# EAGLE design TI_amp (EAGLE 6.5.0)
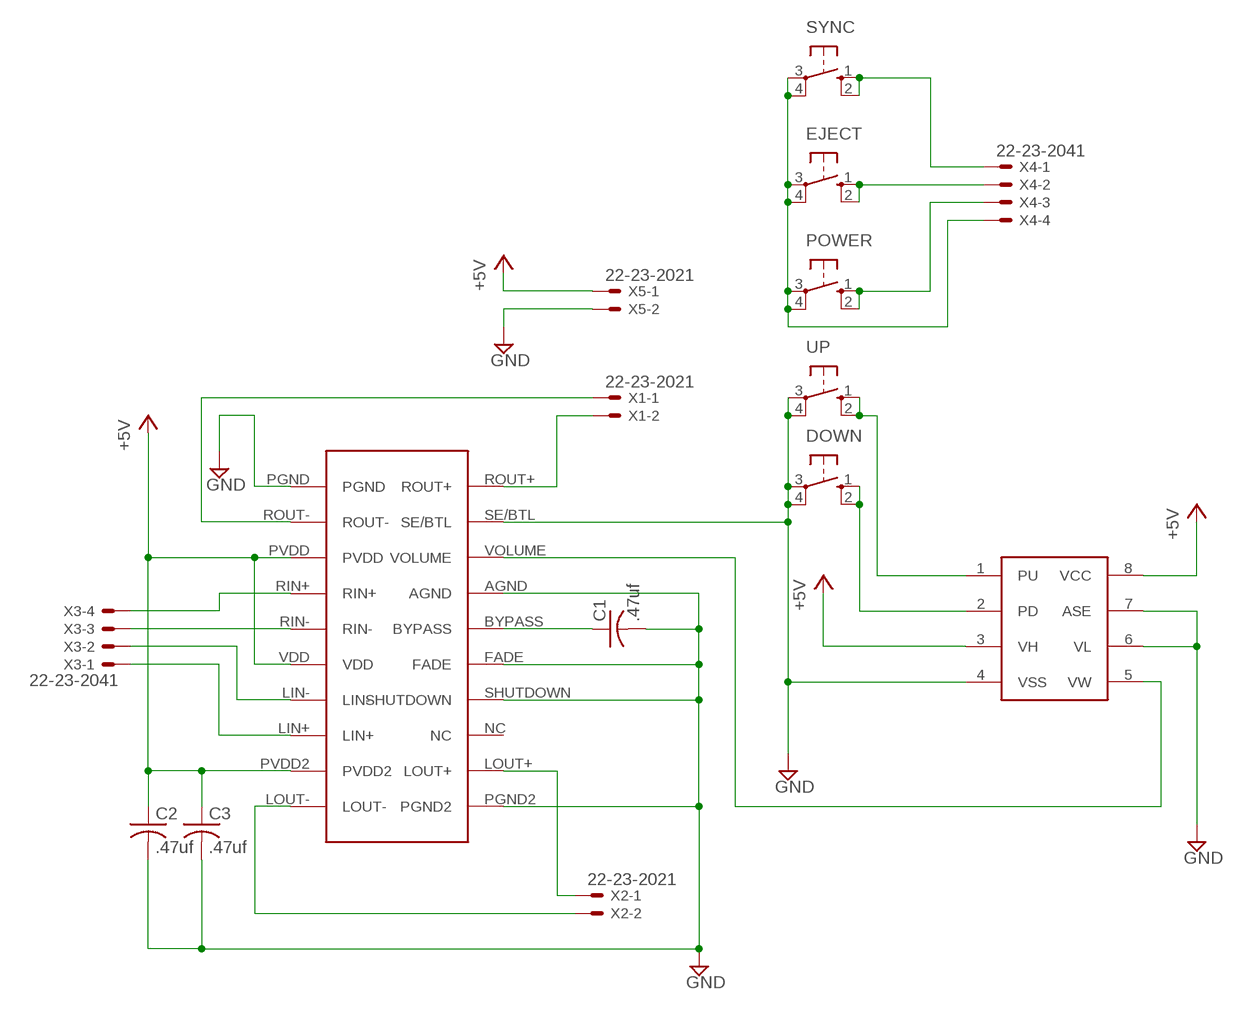
[diagram p0: schematic, sheet 1]

## Parts
C1  .47uf  C-USC1206  [C1206]
C2  .47uf  C-USC1206  [C1206]
C3  .47uf  C-USC1206  [C1206]
DOWN  10-XX  [B3F-10XX]
EJECT  10-XX  [B3F-10XX]
POWER  10-XX  [B3F-10XX]
SYNC  10-XX  [B3F-10XX]
U$1  TPA6021A4  [DIP-20]
U$2  X9511  [SOIC-8]
UP  10-XX  [B3F-10XX]
X1  22-23-2021  [22-23-2021]
X2  22-23-2021  [22-23-2021]
X3  22-23-2041  [22-23-2041]
X4  22-23-2041  [22-23-2041]
X5  22-23-2021  [22-23-2021]

## Nets
+5V: C2.1 C3.1 U$1.PVDD U$1.PVDD2 U$1.VDD U$2.3(VH) U$2.8(VCC) X5.1
GND: C1.2 C2.2 C3.2 DOWN.3(P) DOWN.4(P1) U$1.AGND U$1.FADE U$1.PGND U$1.PGND2 U$1.SE/BTL U$1.SHUTDOWN U$2.4(VSS) U$2.6(VL) U$2.7(ASE) UP.3(P) UP.4(P1) X5.2
N$1: DOWN.1(S) DOWN.2(S1) U$2.2(PD)
N$2: U$2.1(PU) UP.1(S) UP.2(S1)
N$3: U$1.VOLUME U$2.5(VW)
N$4: EJECT.3(P) EJECT.4(P1) POWER.3(P) POWER.4(P1) SYNC.3(P) SYNC.4(P1) X4.4
N$5: POWER.1(S) POWER.2(S1) X4.3
N$6: C1.1 U$1.BYPASS
N$7: EJECT.1(S) EJECT.2(S1) X4.2
N$8: U$1.ROUT+ X1.2
N$9: U$1.ROUT- X1.1
N$10: U$1.LOUT+ X2.1
N$11: U$1.LOUT- X2.2
N$12: SYNC.1(S) SYNC.2(S1) X4.1
N$13: U$1.RIN+ X3.4
N$14: U$1.RIN- X3.3
N$15: U$1.LIN- X3.2
N$16: U$1.LIN+ X3.1
Unconnected: U$1.NC

## Library data of the parts
C1-C3 = rcl:C-US: CAPACITOR, American symbol
DOWN EJECT POWER SYNC UP = switch-omron:10-XX: OMRON SWITCH; MPN: B3F-1000; OC_FARNELL: 176432; OC_NEWARK: 36M3542
U$1 = TI_Audio_Amp:TPA6021A4
U$2 = X9511:X9511
X1 X2 X5 = con-molex:22-23-2021: .100" (2.54mm) Center Header - 2 Pin; MF: MOLEX; MPN: 22-23-2021; OC_FARNELL: 1462926; OC_NEWARK: 25C3832
X3 X4 = con-molex:22-23-2041: .100" (2.54mm) Center Header - 4 Pin; MF: MOLEX; MPN: 22-23-2041; OC_FARNELL: 1462920; OC_NEWARK: 38C0355

## Board
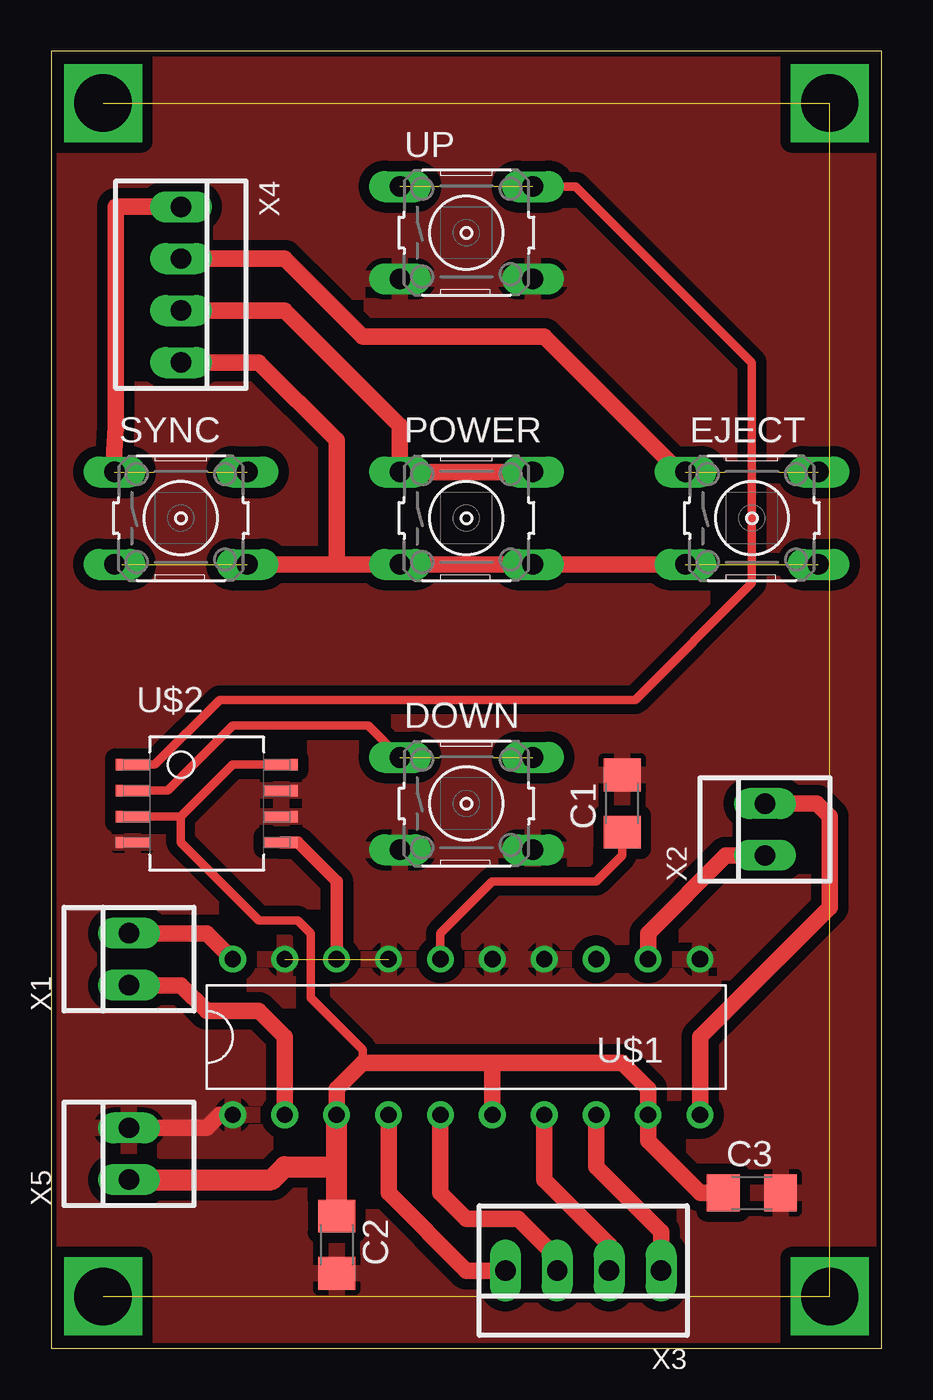
[diagram p1: board, top side]

Size 40.64 x 63.5 mm. Coordinates in mm from the lower left corner, seen from the top.
Outline: 0,0 40.64,0 40.64,63.5 0,63.5 0,0
Copper layers (1*16): Top 0.035mm / dielectric 1.5mm / Bottom 0.035mm
Design rules "SeeedStudio_2layer_DRU_no_angle_20140221 *": minimum track width 6mil, minimum drill 12mil, track to track 20mil, track to pad 20mil, pad to pad 6mil, via to via 6mil, smd to smd 0mil, copper to edge 10mil, drill to drill 10mil, minimum pad ring 10mil, minimum via ring 6mil, stop-mask expansion 2mil, vias tented up to drill 100mil, thermal gap 10mil

### Footprints (pad centres in the part's own frame; a part is rotated, then mirrored left to right if it is on the bottom)
C1206 = smd 1.6 x 1.8: 1 -1.4,0; 2 1.4,0
B3F-10XX = drill 1.016 long: 1 -3.251,2.261; 2 3.251,2.261; 3 -3.251,-2.261; 4 3.251,-2.261
DIP-20 = drill 0.8: AGND 3.81,3.81; BYPASS 3.81,1.27; FADE 3.81,-1.27; LIN+ -3.81,-6.35; LIN- -3.81,-3.81; LOUT+ 3.81,-8.89; LOUT- -3.81,-11.43; NC 3.81,-6.35; PGND -3.81,11.43; PGND2 3.81,-11.43; PVDD -3.81,6.35; PVDD2 -3.81,-8.89; RIN+ -3.81,3.81; RIN- -3.81,1.27; ROUT+ 3.81,11.43; ROUT- -3.81,8.89; SE/BTL 3.81,8.89; SHUTDOWN 3.81,-3.81; VDD -3.81,-1.27; VOLUME 3.81,6.35
SOIC-8 = smd 1.651 x 0.559: 1 -3.632,1.905; 2 -3.632,0.635; 3 -3.632,-0.635; 4 -3.632,-1.905; 5 3.632,-1.905; 6 3.632,-0.635; 7 3.632,0.635; 8 3.632,1.905
22-23-2021 = drill 1 long: 1 -1.27,0; 2 1.27,0
22-23-2041 = drill 1 long: 1 -3.81,0; 2 -1.27,0; 3 1.27,0; 4 3.81,0

### Placement (x,y rotation side)
C1  27.94,26.67 90 top
C2  13.97,5.08 270 top
C3  34.29,7.62 0 top
DOWN  20.32,26.67 0 top
EJECT  34.29,40.64 0 top
POWER  20.32,40.64 0 top
SYNC  6.35,40.64 0 top
U$1  20.32,15.24 90 top
U$2  7.62,26.67 0 top
UP  20.32,54.61 0 top
X1  3.81,19.05 90 top
X2  34.92,25.4 90 top
X3  26.04,3.81 180 top
X4  6.35,52.07 270 top
X5  3.81,9.53 90 top

### Tracks (layer width: path | path; a pad name or v marks a point on that pad's centre or on a via)
+5V
  Top 0.406: U$2.3 6.35,26.04 | 6.35,26.04 8.89,28.57 U$2.8 | 15.24,13.97 15.24,14.61 12.7,17.14 12.7,20.32 12.06,20.95 10.16,20.95 6.35,24.77 6.35,26.04
  Top 0.813: C3.1 31.75,7.62 29.21,10.16 U$1.PVDD2 29.21,12.7 27.94,13.97 21.59,13.97 | U$1.PVDD 13.97,12.7 15.24,13.97 21.59,13.97 | U$1.VDD 21.59,13.97
  Top 1.016: X5.1 10.79,8.26 11.43,8.89 13.84,8.89 13.97,8.76 C2.1 U$1.PVDD
GND  (1 unrouted)
  Top 0.813: X5.2 7.62,10.79 8.26,11.43
  pour Top: -1.27,64.77 41.91,64.77 41.91,-1.27 -1.27,-1.27
N$1  (1 unrouted)
  Top 0.406: U$2.2 5.71,27.3 8.89,30.48 15.52,30.48 DOWN.1
N$2  (1 unrouted)
  Top 0.406: UP.2 25.68,56.87 34.29,48.26 34.29,37.47 28.57,31.75 8.26,31.75 5.08,28.57 U$2.1
N$3
  Top 0.61: U$2.5 12.06,24.77 13.97,22.86 U$1.VOLUME
N$4  (2 unrouted)
  Top 0.813: EJECT.3 POWER.4 POWER.3 13.97,38.38 | 13.97,38.38 SYNC.4 | SYNC.3 3.45,38.38 | X4.4 10.16,48.26 13.97,44.45 13.97,38.38
N$5
  Top 0.813: POWER.2 POWER.1 17.07,45.16 11.43,50.8 X4.3
N$6
  Top 0.406: C1.1 27.94,24.13 26.67,22.86 21.59,22.86 19.05,20.32 U$1.BYPASS
N$7  (1 unrouted)
  Top 0.813: EJECT.1 30.76,42.9 24.13,49.53 15.24,49.53 11.43,53.34 X4.2
N$8
  Top 0.813: X1.2 7.62,20.32 U$1.ROUT+
N$9
  Top 0.813: U$1.ROUT- 11.43,15.24 10.16,16.51 7.62,16.51 6.35,17.78 X1.1
N$10
  Top 0.813: X2.1 33.02,24.13 29.21,20.32 U$1.LOUT+
N$11
  Top 0.813: X2.2 37.47,26.67 38.1,26.04 38.1,21.59 31.75,15.24 U$1.LOUT-
N$12  (1 unrouted)
  Top 0.813: SYNC.1 3.1,43.89 3.17,45.09 3.17,55.88 X4.1
N$13
  Top 0.813: X3.4 20.32,3.81 16.51,7.62 U$1.RIN+
N$14
  Top 0.813: X3.3 24.77,4.45 22.86,6.35 20.32,6.35 19.05,7.62 U$1.RIN-
N$15
  Top 0.813: X3.2 27.3,5.08 24.13,8.26 U$1.LIN-
N$16
  Top 0.813: X3.1 29.84,5.71 26.67,8.89 U$1.LIN+
N$17  (via drill 2.8)  (3 unrouted)
  other vias: 2.54,2.54 38.1,2.54 2.54,60.96 38.1,60.96